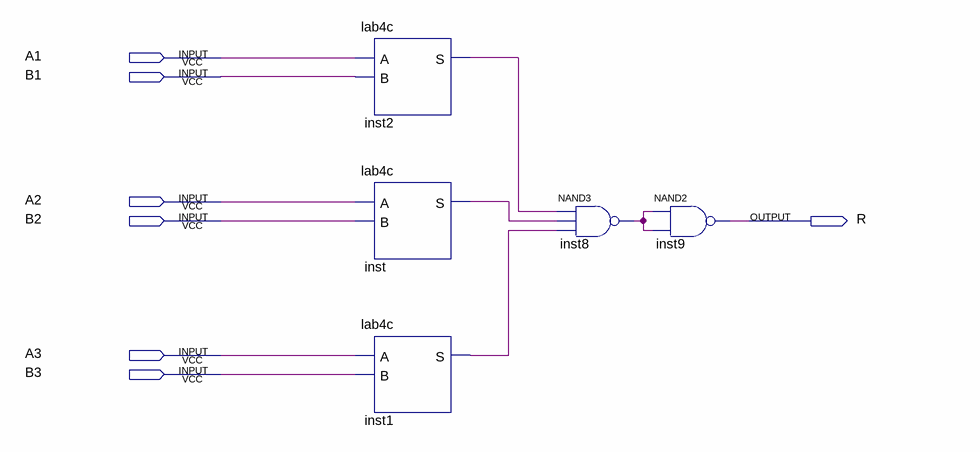
[diagram p0: schematic sheet]
// Quartus schematic lab4a.bdf as structural Verilog: 5 symbols, 7 pins
module lab4a (
  input  A1,
  input  B1,
  input  A2,
  input  B2,
  input  A3,
  input  B3,
  output R
);

  wire inst1_s, inst2_s, inst8_out, inst_s;

  lab4c inst2 (.A(A1), .B(B1), .S(inst2_s));
  lab4c inst (.A(A2), .B(B2), .S(inst_s));
  lab4c inst1 (.A(A3), .B(B3), .S(inst1_s));
  nand inst8 (inst8_out, inst2_s, inst_s, inst1_s);
  nand inst9 (R, inst8_out, inst8_out);
endmodule
